# EAGLE design hall_sensor_v2 (EAGLE 7.5.0)
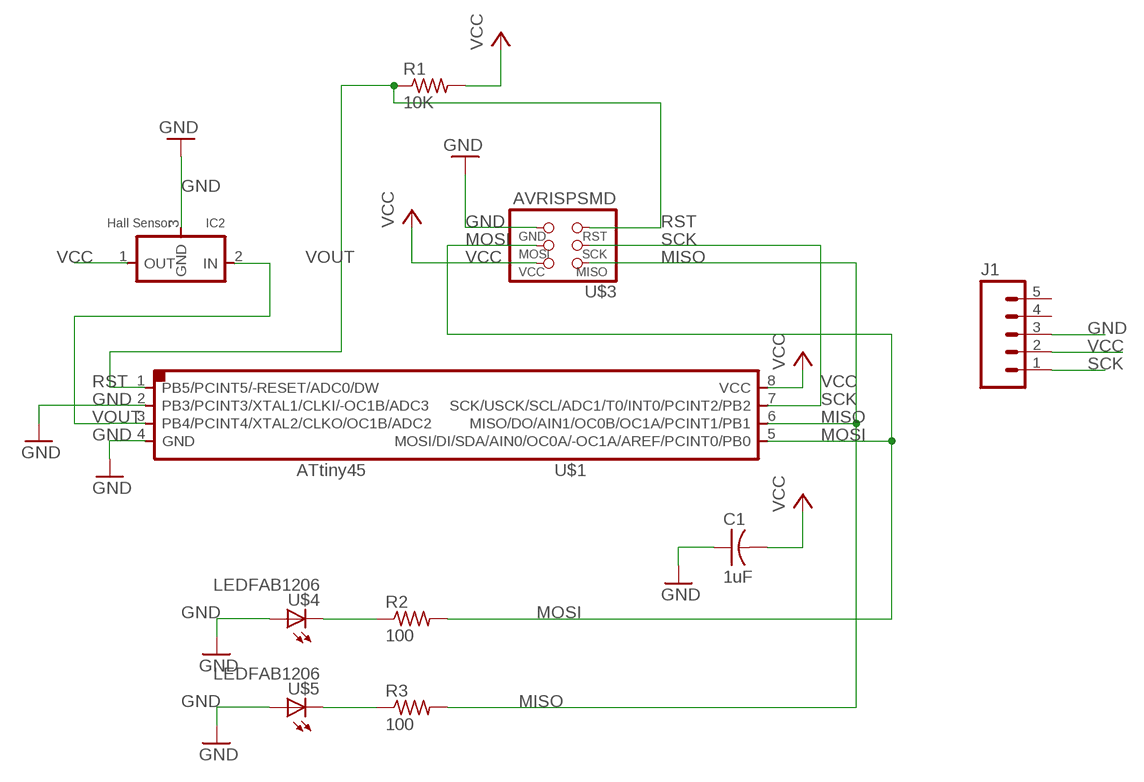
[diagram p0: schematic, sheet 1]

## Parts
C1  1uF  CAP-US1206FAB  [C1206FAB]
IC2  Hall Sensor  REGULATORSOT23  [SOT23]
J1  M05LOCK  [1X05_LOCK]
R1  10K  RES-US1206FAB  [R1206FAB]
R2  100  RES-US1206FAB  [R1206FAB]
R3  100  RES-US1206FAB  [R1206FAB]
U$1  ATTINY45SI  [SOIC8]
U$3  AVRISPSMD  [2X03SMD]
U$4  LEDFAB1206  [LED1206FAB]
U$5  LEDFAB1206  [LED1206FAB]

## Nets
GND: C1.1 IC2.3(GND) J1.3 U$1.2(PB3/PCINT3/XTAL1/CLKI/-OC1B/ADC3) U$1.4(GND) U$3.6(GND) U$4.1(A) U$5.1(A)
MISO: R3.2 U$1.6(MISO/DO/AIN1/OC0B/OC1A/PCINT1/PB1) U$3.1(MISO)
MOSI: R2.2 U$1.5(MOSI/DI/SDA/AIN0/OC0A/-OC1A/AREF/PCINT0/PB0) U$3.4(MOSI)
N$1: R2.1 U$4.2(C)
N$2: R3.1 U$5.2(C)
RST: R1.1 U$1.1(PB5/PCINT5/-RESET/ADC0/DW) U$3.5(RST)
SCK: J1.1 U$1.7(SCK/USCK/SCL/ADC1/T0/INT0/PCINT2/PB2) U$3.3(SCK)
VCC: C1.2 IC2.1(OUT) J1.2 R1.2 U$1.8(VCC) U$3.2(VCC)
VOUT: IC2.2(IN) U$1.3(PB4/PCINT4/XTAL2/CLKO/OC1B/ADC2)
Unconnected: J1.4 J1.5

## Library data of the parts
C1 = fab (1):CAP-US
IC2 = fab (1):REGULATOR
J1 = SparkFun-Connectors:M05: Header 5 Standard 5-pin 0.1" header. Use with straight break away headers (SKU : PRT-00116), right angle break away headers (PRT-00553), swiss pins (PRT-00743), machine pins (PRT-00117), and female headers (PRT-00115). Molex polarized connector foot print use with SKU : PRT-08230 with associated crimp pins and housings.
R1-R3 = fab (1):RES-US: Resistor (US Symbol) Variants with postfix FAB are widened to allow the routing of internal traces
U$1 = fab (1):ATTINY45
U$3 = fab (1):AVRISP
U$4 U$5 = fab (1):LED: LED

## Board
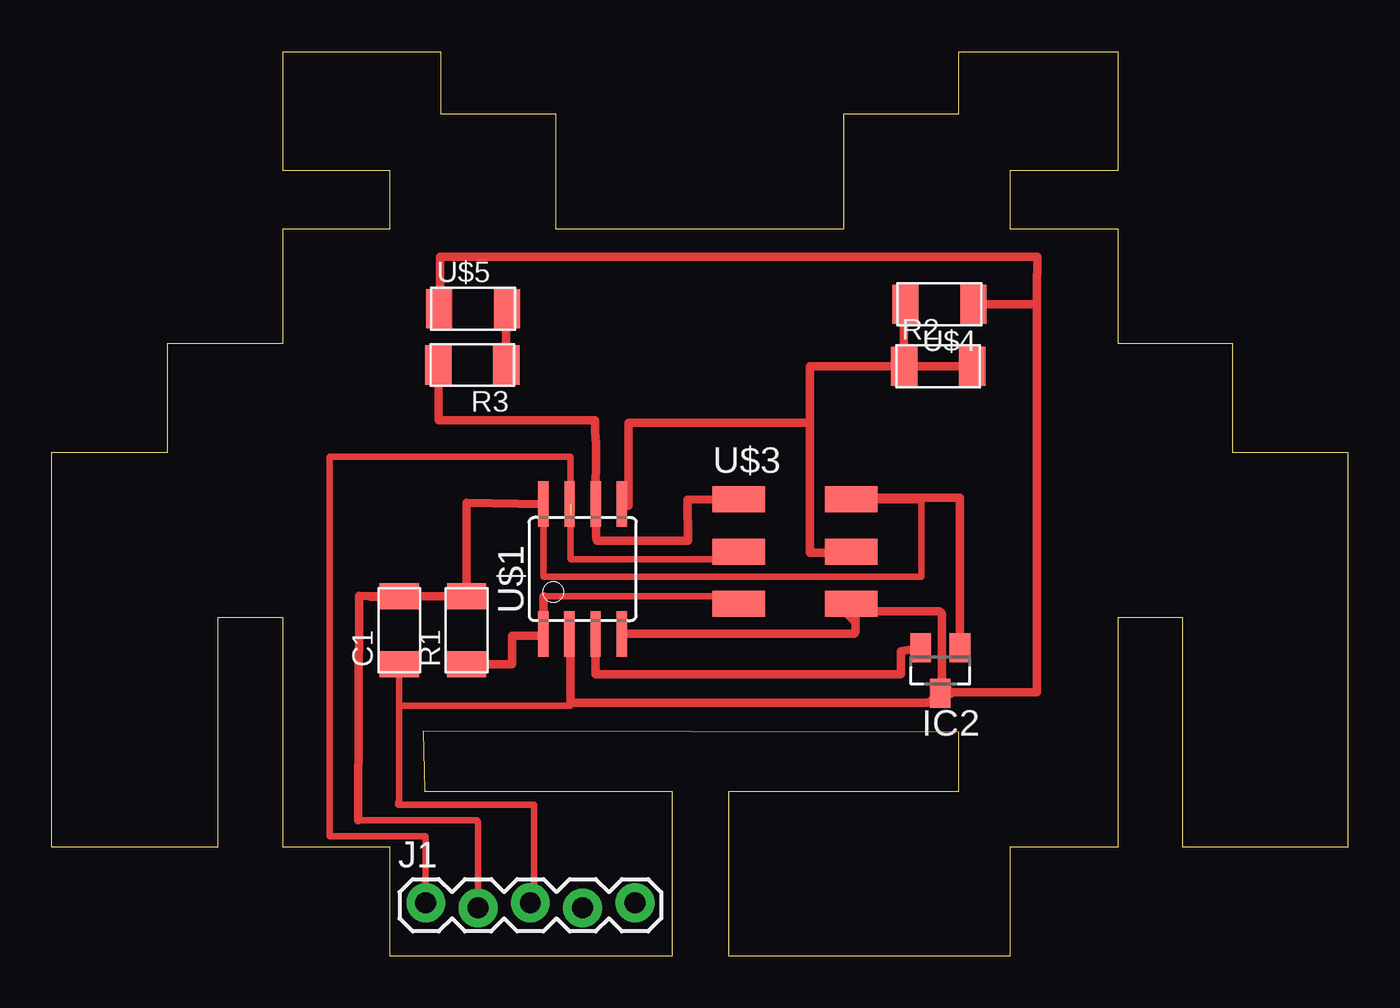
[diagram p1: board, top side]

Size 62.96 x 43.91 mm. Coordinates in mm from the lower left corner, seen from the top.
Outline: 16.45,5.27 11.24,5.27 11.24,16.41 8.06,16.41 8.06,5.27 0,5.27 0,24.45 5.65,24.45 5.65,29.75 11.24,29.75 11.24,35.31 16.45,35.31 16.45,38.13 11.24,38.13 11.24,43.91 18.89,43.91 18.89,40.89 24.48,40.89 24.48,35.31 38.48,35.31 38.48,40.89 44.07,40.89 44.07,43.91 51.78,43.91 51.78,38.13 46.55,38.13 46.55,35.31 51.78,35.31 51.78,29.75 57.34,29.75 57.34,24.45 62.96,24.45 62.96,5.27 54.93,5.27 54.93,16.41 51.78,16.41 51.78,5.27 46.55,5.27 46.55,0 32.89,0 32.89,8 44.07,8 44.07,10.86 18.05,10.91 18.13,8 30.13,8 30.13,0 16.45,0 16.45,5.27
Copper layers (1*16): Top 0.035mm / dielectric 1.5mm / Bottom 0.035mm
Design rules "default *": minimum track width 10mil, minimum drill 24mil, track to track 16mil, track to pad 16mil, pad to pad 16mil, via to via 16mil, smd to smd 16mil, copper to edge 40mil, drill to drill 8mil, minimum pad ring 10mil, minimum via ring 8mil, stop-mask expansion 4mil, vias tented up to drill 0mil, thermal gap 10mil

### Footprints (pad centres in the part's own frame; a part is rotated, then mirrored left to right if it is on the bottom)
C1206FAB = smd 1.27 x 1.905: 1 -1.651,0; 2 1.651,0
SOT23 = smd 1 x 1.4: 1 -0.95,-1.1; 2 0.95,-1.1; 3 0,1.1
1X05_LOCK = drill 1.016 pad 1.88: 1 0,0.127; 2 2.54,-0.127; 3 5.08,0.127; 4 7.62,-0.127; 5 10.16,0.127
R1206FAB = smd 1.27 x 1.905: 1 -1.651,0; 2 1.651,0
SOIC8 = smd 0.5 x 2.2: 1 -1.905,-3.154; 2 -0.645,-3.154; 3 0.625,-3.154; 4 1.895,-3.154; 5 1.905,3.154; 6 0.635,3.154; 7 -0.635,3.154; 8 -1.905,3.154
2X03SMD = smd 2.54 x 1.27: 1 -2.54,2.54; 2 2.92,2.54; 3 -2.54,0; 4 2.92,0; 5 -2.54,-2.54; 6 2.92,-2.54
LED1206FAB = smd 1.27 x 1.905: 1 -1.651,0; 2 1.651,0

### Placement (x,y rotation side)
C1  16.89,15.81 90 top
IC2  43.16,13.86 180 top
J1  18.17,2.46 0 top
R1  20.16,15.81 90 top
R2  43.06,28.64 0 top
R3  20.43,28.69 180 top
U$1  25.79,18.79 0 top
U$3  35.92,19.63 0 top
U$4  43.12,31.63 180 top
U$5  20.47,31.42 0 top

### Tracks (layer width: path | path; a pad name or v marks a point on that pad's centre or on a via)
GND
  Top 0.305: U$1.2 25.2,15.63 | 25.2,12.29 25.2,12.16 16.89,12.16 C1.1 16.89,7.46 16.82,7.46 16.82,7.34 23.42,7.34 23.42,2.59 J1.3
  Top 0.406: U$4.1 47.86,31.63 | 47.86,31.63 47.86,12.8 43.68,12.8 | 43.68,12.8 43.68,12.72 43.16,12.72 IC2.3 42.56,12.29 25.2,12.29 25.2,15.63 | U$5.1 18.87,31.42 18.87,33.95 47.88,33.95 47.88,33.09 47.86,33.09 47.86,31.63 | U$1.4 38.96,15.63 39.05,15.72 39.05,16.23 | 39.05,16.23 39.05,16.89 U$3.6 | 39.05,16.23 38.16,17.11 38.16,16.99 38.41,16.73 43.11,16.73 43.24,16.61 43.24,13.24 43.68,12.8
MISO
  Top 0.406: U$3.1 30.89,22.15 30.92,20.15 26.5,20.15 26.45,20.36 26.43,20.36 U$1.6 26.43,24.84 26.39,25.47 26.39,26.02 18.8,26.02 18.8,28.69 R3.2
MOSI
  Top 0.406: R2.2 36.83,28.64 36.83,25.88 | 36.83,25.88 36.83,19.58 38.84,19.58 U$3.4 | U$1.5 28.02,21.87 28.02,25.88 36.83,25.88
N$1
  Top 0.406: U$4.2 41.4,31.63 R2.1
N$2
  Top 0.406: U$5.2 22.09,31.42 R3.1
RST
  Top 0.305: U$3.5 arc90 33,17.48 23.89,17.48
  Top 0.406: R1.1 22.36,14.16 22.36,15.54 23.89,15.54 U$1.1 23.89,17.48
SCK  (1 unrouted)
  Top 0.305: U$3.3 arc-90 33.02,19.27 25.2,19.27 25.2,21.43 | U$1.7 25.2,21.94 25.2,24.23 13.52,24.23 13.52,5.81 18.17,5.81 J1.1
VCC
  Top 0.305: 14.89,6.58 20.67,6.58 arc90 20.71,6.5 J1.2 | 42.23,22.17 42.23,18.4 23.89,18.4 U$1.8
  Top 0.406: 44.12,14.95 IC2.1 44.11,22.24 39.14,22.24 39.14,22.17 U$3.2 | U$3.2 arc-90 38.98,22.32 | 14.89,6.58 14.94,17.49 C1.2 15.5,17.45 16.28,17.45 15.39,17.46 R1.2 20.16,21.99 U$1.8 | U$3.2 42.23,22.17
VOUT
  Top 0.406: IC2.2 41.25,14.79 41.25,13.67 26.42,13.67 U$1.3